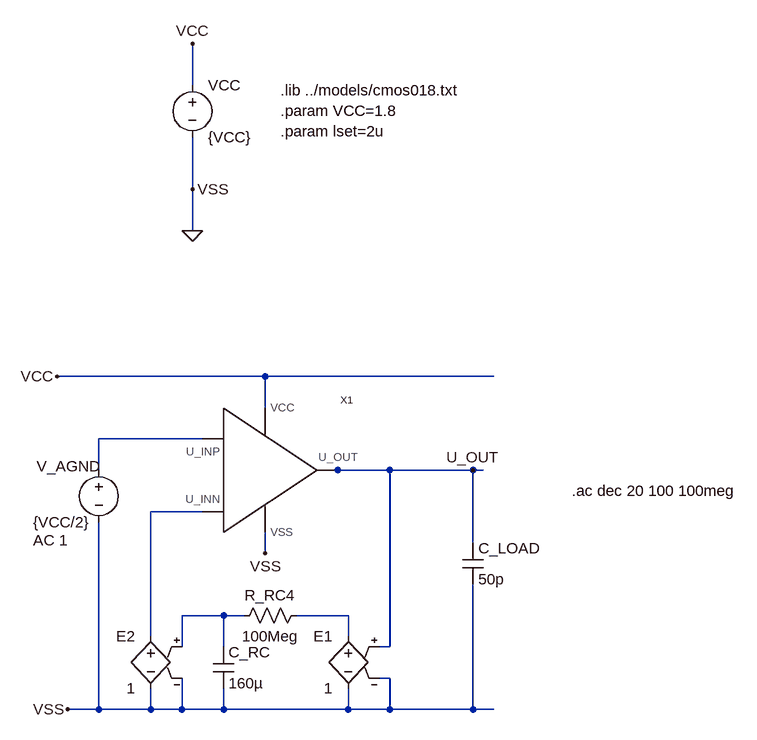
[diagram p0: schematic aplikace_AC.asc]
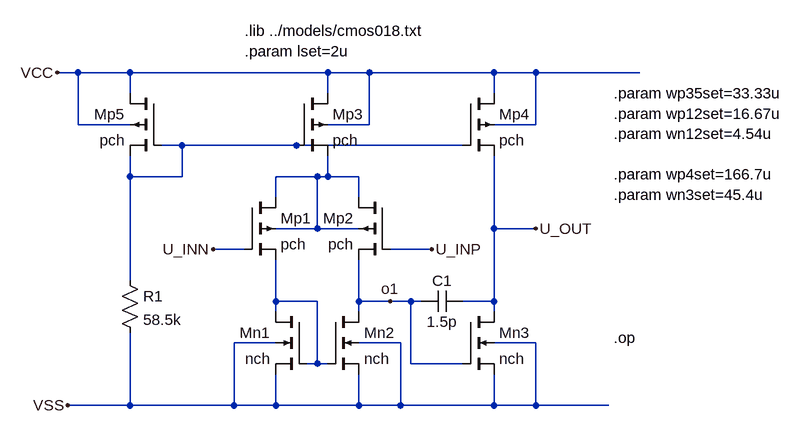
[diagram p1: sub-circuit customota.asc]
aplikace_AC.asc, the LTspice schematic file:
Version 4
SHEET 1 2972 2004
WIRE 928 -272 928 -336
WIRE 928 -112 928 -192
WIRE 928 -48 928 -112
WIRE 1040 176 720 176
WIRE 1392 176 1040 176
WIRE 1040 224 1040 176
WIRE 944 272 784 272
WIRE 784 320 784 272
WIRE 1152 320 1136 320
WIRE 1232 320 1152 320
WIRE 1360 320 1232 320
WIRE 1376 320 1360 320
WIRE 944 384 864 384
WIRE 1360 432 1360 320
WIRE 1040 448 1040 416
WIRE 976 544 912 544
WIRE 1008 544 976 544
WIRE 1168 544 1088 544
WIRE 864 576 864 384
WIRE 1168 576 1168 544
WIRE 912 592 912 544
WIRE 976 592 976 544
WIRE 1232 592 1232 320
WIRE 1232 592 1216 592
WIRE 1232 640 1216 640
WIRE 784 688 784 400
WIRE 784 688 736 688
WIRE 864 688 864 656
WIRE 864 688 784 688
WIRE 912 688 912 640
WIRE 912 688 864 688
WIRE 976 688 976 656
WIRE 976 688 912 688
WIRE 1168 688 1168 656
WIRE 1168 688 976 688
WIRE 1232 688 1232 640
WIRE 1232 688 1168 688
WIRE 1360 688 1360 496
WIRE 1360 688 1232 688
WIRE 1392 688 1360 688
FLAG 928 -48 0
FLAG 928 -336 VCC
FLAG 720 176 VCC
FLAG 736 688 VSS
FLAG 928 -112 VSS
FLAG 1040 448 VSS
FLAG 1360 320 U_OUT
SYMBOL voltage 928 -288 R0
WINDOW 123 0 0 Left 0
WINDOW 39 0 0 Left 0
SYMATTR InstName VCC
SYMATTR Value {VCC}
SYMBOL customOTA 1024 256 R0
SYMATTR InstName X1
SYMBOL voltage 784 304 R0
WINDOW 0 -96 10 Left 2
WINDOW 3 -101 96 Left 2
WINDOW 123 -101 124 Left 2
WINDOW 39 0 0 Left 0
SYMATTR InstName V_AGND
SYMATTR Value {VCC/2}
SYMATTR Value2 AC 1
SYMBOL e 1168 560 M0
SYMATTR InstName E1
SYMATTR Value 1
SYMBOL e 864 560 M0
SYMATTR InstName E2
SYMATTR Value 1
SYMBOL cap 1344 432 R0
SYMATTR InstName C_LOAD
SYMATTR Value 50p
SYMBOL cap 960 592 R0
SYMATTR InstName C_RC
SYMATTR Value 160µ
SYMBOL res 1104 528 R90
WINDOW 0 0 56 VBottom 2
WINDOW 3 32 56 VTop 2
SYMATTR InstName R_RC4
SYMATTR Value 100Meg
TEXT 1064 -264 Left 2 !.lib ../models/cmos018.txt\n.param VCC=1.8\n.param lset=2u
TEXT 1512 352 Left 2 !.ac dec 20 100 100meg

customota.asc, the sub-circuit schematic file:
Version 4
SHEET 1 2972 2004
WIRE 752 176 720 176
WIRE 832 176 752 176
WIRE 1136 176 832 176
WIRE 1200 176 1136 176
WIRE 1392 176 1200 176
WIRE 1456 176 1392 176
WIRE 1616 176 1456 176
WIRE 832 208 832 176
WIRE 1136 208 1136 176
WIRE 1392 208 1392 176
WIRE 752 256 752 176
WIRE 832 256 752 256
WIRE 1200 256 1200 176
WIRE 1200 256 1136 256
WIRE 1456 256 1456 176
WIRE 1456 256 1392 256
WIRE 912 288 880 288
WIRE 1088 288 912 288
WIRE 1344 288 1088 288
WIRE 832 336 832 304
WIRE 912 336 912 288
WIRE 912 336 832 336
WIRE 1120 336 1056 336
WIRE 1136 336 1136 304
WIRE 1136 336 1120 336
WIRE 1184 336 1136 336
WIRE 1056 368 1056 336
WIRE 1184 368 1184 336
WIRE 1120 416 1120 336
WIRE 1120 416 1056 416
WIRE 1184 416 1120 416
WIRE 1392 416 1392 304
WIRE 1456 416 1392 416
WIRE 1008 448 960 448
WIRE 1296 448 1232 448
WIRE 832 496 832 336
WIRE 1056 528 1056 464
WIRE 1120 528 1056 528
WIRE 1184 528 1184 464
WIRE 1232 528 1184 528
WIRE 1264 528 1232 528
WIRE 1280 528 1264 528
WIRE 1392 528 1392 416
WIRE 1392 528 1344 528
WIRE 1056 544 1056 528
WIRE 1184 544 1184 528
WIRE 1392 544 1392 528
WIRE 1056 592 992 592
WIRE 1248 592 1184 592
WIRE 1456 592 1392 592
WIRE 1120 624 1120 528
WIRE 1120 624 1104 624
WIRE 1136 624 1120 624
WIRE 1264 624 1264 528
WIRE 1344 624 1264 624
WIRE 832 688 832 576
WIRE 832 688 736 688
WIRE 992 688 992 592
WIRE 992 688 832 688
WIRE 1056 688 1056 640
WIRE 1056 688 992 688
WIRE 1184 688 1184 640
WIRE 1184 688 1056 688
WIRE 1248 688 1248 592
WIRE 1248 688 1184 688
WIRE 1392 688 1392 640
WIRE 1392 688 1248 688
WIRE 1456 688 1456 592
WIRE 1456 688 1392 688
WIRE 1568 688 1456 688
FLAG 720 176 VCC
FLAG 736 688 VSS
FLAG 960 448 U_INN
FLAG 1296 448 U_INP
FLAG 1232 528 o1
FLAG 1456 416 U_OUT
DATAFLAG 1440 416 ""
DATAFLAG 976 448 ""
DATAFLAG 1264 448 ""
DATAFLAG 1264 368 "Id(x1:Mp2)"
DATAFLAG 992 368 "Id(x1:Mp1)"
DATAFLAG 1472 224 "Id(x1:Mp4)"
DATAFLAG 848 400 "Id(x1:Mp5)"
DATAFLAG 1088 208 "Id(x1:Mp3)"
SYMBOL nmos4 1136 544 R0
SYMATTR InstName Mn2
SYMATTR Value nch
SYMATTR Value2 l=lset w=wn12set
SYMBOL pmos4 1008 368 R0
SYMATTR InstName Mp1
SYMATTR Value pch
SYMATTR Value2 l=lset w=wp12set
SYMBOL nmos4 1104 544 M0
SYMATTR InstName Mn1
SYMATTR Value nch
SYMATTR Value2 l=lset w=wn12set
SYMBOL nmos4 1344 544 R0
SYMATTR InstName Mn3
SYMATTR Value nch
SYMATTR Value2 l=lset w=wn3set
SYMBOL pmos4 1232 368 M0
SYMATTR InstName Mp2
SYMATTR Value pch
SYMATTR Value2 l=lset w=wp12set
SYMBOL pmos4 1088 208 R0
SYMATTR InstName Mp3
SYMATTR Value pch
SYMATTR Value2 l=lset w=wp35set
SYMBOL pmos4 1344 208 R0
SYMATTR InstName Mp4
SYMATTR Value pch
SYMATTR Value2 l=lset w=wp4set
SYMBOL pmos4 880 208 M0
SYMATTR InstName Mp5
SYMATTR Value pch
SYMATTR Value2 l=lset w=wp35set
SYMBOL res 816 480 R0
SYMATTR InstName R1
SYMATTR Value 58.5k
SYMBOL cap 1344 512 R90
WINDOW 0 0 32 VBottom 2
WINDOW 3 32 32 VTop 2
SYMATTR InstName C1
SYMATTR Value 1.5p
TEXT 1008 112 Left 2 !.lib ../models/cmos018.txt\n.param lset=2u
TEXT 1576 208 Left 2 !.param wp35set=33.33u\n.param wp12set=16.67u\n.param wn12set=4.54u\n \n.param wp4set=166.7u\n.param wn3set=45.4u
TEXT 1576 584 Left 2 !.op

The netlist it stands for:
* aplikace_AC.asc
VCC VCC 0 {VCC}
XX1 VCC 0 N001 N002 U_OUT customota
V_AGND N001 0 {VCC/2} AC 1
E1 N004 0 U_OUT 0 1
E2 N002 0 N003 0 1
C_LOAD U_OUT 0 50p
C_RC N003 0 160µ
R_RC4 N004 N003 100Meg

* block symbol definitions
.subckt customota VCC VSS U_INP U_INN U_OUT
Mn2 o1 N003 VSS VSS nch l=lset w=wn12set
Mp1 N002 U_INN N003 N002 pch l=lset w=wp12set
Mn1 N003 N003 VSS VSS nch l=lset w=wn12set
Mn3 U_OUT o1 VSS VSS nch l=lset w=wn3set
Mp2 N002 U_INP o1 N002 pch l=lset w=wp12set
Mp3 VCC N001 N002 VCC pch l=lset w=wp35set
Mp4 VCC N001 U_OUT VCC pch l=lset w=wp4set
Mp5 VCC N001 N001 VCC pch l=lset w=wp35set
R1 N001 VSS 58.5k
C1 U_OUT o1 1.5p
.lib ../models/cmos018.txt
.param lset=2u
.param wp35set=33.33u
.param wp12set=16.67u
.param wn12set=4.54u
.param wp4set=166.7u
.param wn3set=45.4u
.op
.ends customota

.model NMOS NMOS
.model PMOS PMOS
.lib standard.mos
.lib ../models/cmos018.txt
.param VCC=1.8
.param lset=2u
.ac dec 20 100 100meg
.backanno
.end